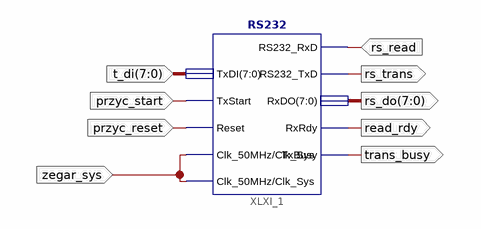
[diagram p0: schematic sheet 1]
// Xilinx ISE schematic RECEIVER.sch (spartan3e) as structural Verilog: 1 symbols, 9 ports
module RECEIVER (
  input  rs_read,
  input  przyc_reset,
  input  przyc_start,
  input  [7:0] t_di,
  input  zegar_sys,
  output trans_busy,
  output read_rdy,
  output rs_trans,
  output [7:0] rs_do
);

  RS232 XLXI_1 (
    .Clk_50MHz(zegar_sys), .Reset(przyc_reset), .RS232_RxD(rs_read), .TxStart(przyc_start), .TxDI(t_di),
    .TxBusy(trans_busy), .RxRdy(read_rdy), .RS232_TxD(rs_trans), .RxDO(rs_do), .Clk_Sys(zegar_sys));
endmodule
